# EAGLE design Board_760032 (EAGLE 9.6.2)
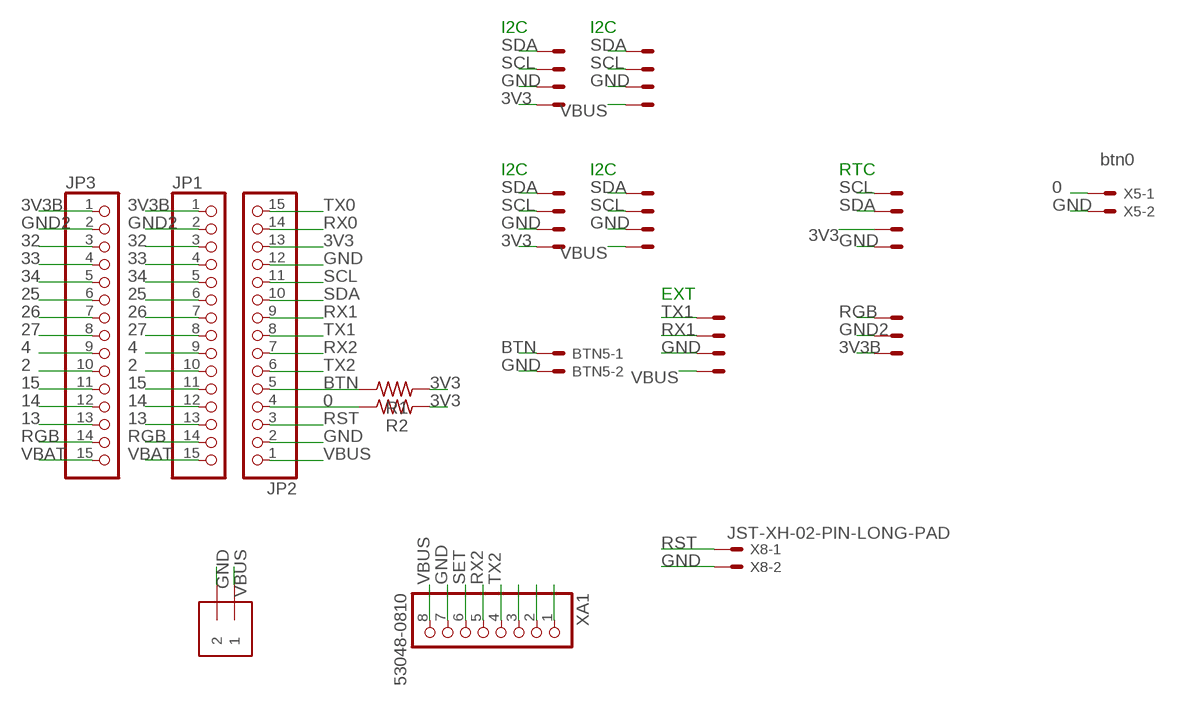
[diagram p0: schematic, sheet 1]

## Parts
BTN5  JST-XH-02-PIN-LONG-PAD  [JST-XH-02-PACKAGE-LONG-PAD]
J1  1X2-3.5MM  [1X2-3.5MM]
JP1  PINHD-1X15  [1X15]
JP2  PINHD-1X15  [1X15]
JP3  PINHD-1X15  [1X15]
R1  R-US_0207/7  [0207/7]
R2  R-US_0207/7  [0207/7]
RTC  JST-XH-04-PIN-LONG-PAD  [JST-XH-04-PACKAGE-LONG-PAD]
X1  JST-XH-04-PIN-LONG-PAD  [JST-XH-04-PACKAGE-LONG-PAD]
X2  JST-XH-04-PIN-LONG-PAD  [JST-XH-04-PACKAGE-LONG-PAD]
X3  JST-XH-04-PIN-LONG-PAD  [JST-XH-04-PACKAGE-LONG-PAD]
X4  JST-XH-03-PIN-LONG-PAD  [JST-XH-03-PACKAGE-LONG-PAD]
X5  btn0  JST-XH-02-PIN-LONG-PAD  [JST-XH-02-PACKAGE-LONG-PAD]
X6  JST-XH-04-PIN-LONG-PAD  [JST-XH-04-PACKAGE-LONG-PAD]
X8  JST-XH-02-PIN-LONG-PAD  [JST-XH-02-PACKAGE-LONG-PAD]
X9  JST-XH-04-PIN-LONG-PAD  [JST-XH-04-PACKAGE-LONG-PAD]
XA1  53048-0810  [MOLEX_53048-0810]

## Nets
0: JP2.4 R2.1 X5.1
2: JP1.10 JP3.10
3V3: JP2.13 R1.2 R2.2 RTC.3 X1.4 X3.4
3V3B: JP1.1 JP3.1 X4.3
4: JP1.9 JP3.9
13: JP1.13 JP3.13
14: JP1.12 JP3.12
15: JP1.11 JP3.11
25: JP1.6 JP3.6
26: JP1.7 JP3.7
27: JP1.8 JP3.8
32: JP1.3 JP3.3
33: JP1.4 JP3.4
34: JP1.5 JP3.5
BTN: BTN5.1 JP2.5 R1.1
GND: BTN5.2 J1.2 JP2.2 JP2.12 RTC.4 X1.3 X2.3 X3.3 X5.2 X6.3 X8.2 X9.3 XA1.7
GND2: JP1.2 JP3.2 X4.2
N$6: XA1.3
N$7: XA1.2
N$8: XA1.1
RGB: JP1.14 JP3.14 X4.1
RST: JP2.3 X8.1
RX0: JP2.14
RX1: JP2.9 X6.2
RX2: JP2.7 XA1.5
SCL: JP2.11 RTC.1 X1.2 X2.2 X3.2 X9.2
SDA: JP2.10 RTC.2 X1.1 X2.1 X3.1 X9.1
SET: XA1.6
TX0: JP2.15
TX1: JP2.8 X6.1
TX2: JP2.6 XA1.4
VBAT: JP1.15 JP3.15
VBUS: J1.1 JP2.1 X2.4 X6.4 X9.4 XA1.8

## Notes on the sheet
- I2C | I2C
- I2C | I2C | RTC
- EXT

## Library data of the parts
BTN5 X5 X8 = Rembrandt Electronics - JST XH Connectors v1-0:JST-XH-02-PIN: JST XH Connector 2 Pin Wire to board connector. Pitch: 2,54 mm, (0.100") Number of pins: 2 Created by Rembrandt Electronics www.rembrandtelectronics.com
J1 = adafruit:1X2: 3.5mm Terminal block http://www.ladyada.net/library/pcb/eaglelibrary.html
JP1-JP3 = pinhead:PINHD-1X15: PIN HEADER
R1 R2 = rcl:R-US_: RESISTOR, American symbol; SPICEPREFIX: R
RTC X1-X3 X6 X9 = Rembrandt Electronics - JST XH Connectors v1-0:JST-XH-04-PIN: JST XH Connector 2 Pin Wire to board connector. Pitch: 2,54 mm, (0.100") Number of pins: 4 Created by Rembrandt Electronics www.rembrandtelectronics.com
X4 = Rembrandt Electronics - JST XH Connectors v1-0:JST-XH-03-PIN: JST XH Connector 2 Pin Wire to board connector. Pitch: 2,54 mm, (0.100") Number of pins: 3 Created by Rembrandt Electronics www.rembrandtelectronics.com
XA1 = ConectorPlantower:53048-0810: 1.25mm Pitch PicoBlade Header, Right Angle, 8 Circuits Check availability <https://pricing.snapeda.com/parts/53048-0810/Molex/view-part?ref=eda>; AVAILABILITY: In Stock; CHECK_PRICES: https://www.snapeda.com/parts/53048-0810/Molex/view-part/?ref=eda; DESCRIPTION: 8 way through board PCB 90deg header | Molex Incorporated 53048-0810; MF: Molex; MP: 53048-0810; PACKAGE: None; PRICE: None; PURCHASE-URL: https://www.snapeda.com/api/url_track_click_mouser/?unipart_id=53851&manufacturer=Molex&part_name=53048-0810&search_term=picoblade 1.25mm header rightangle 8way; SNAPEDA_LINK: https://www.snapeda.com/parts/53048-0810/Molex/view-part/?ref=snap

## Board
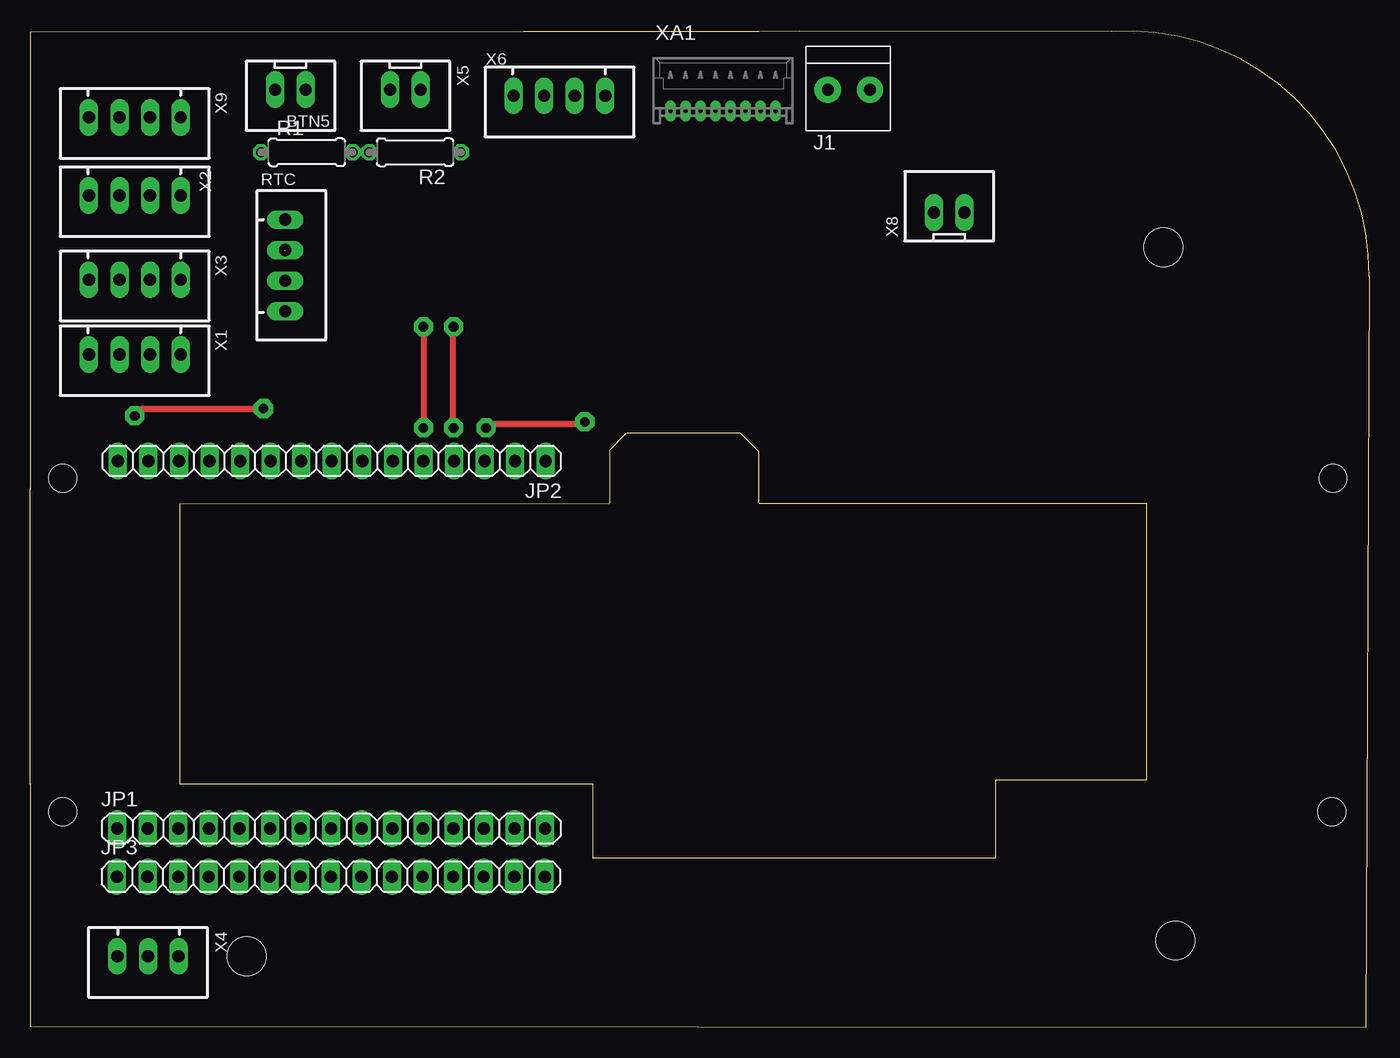
[diagram p1: board, top side]
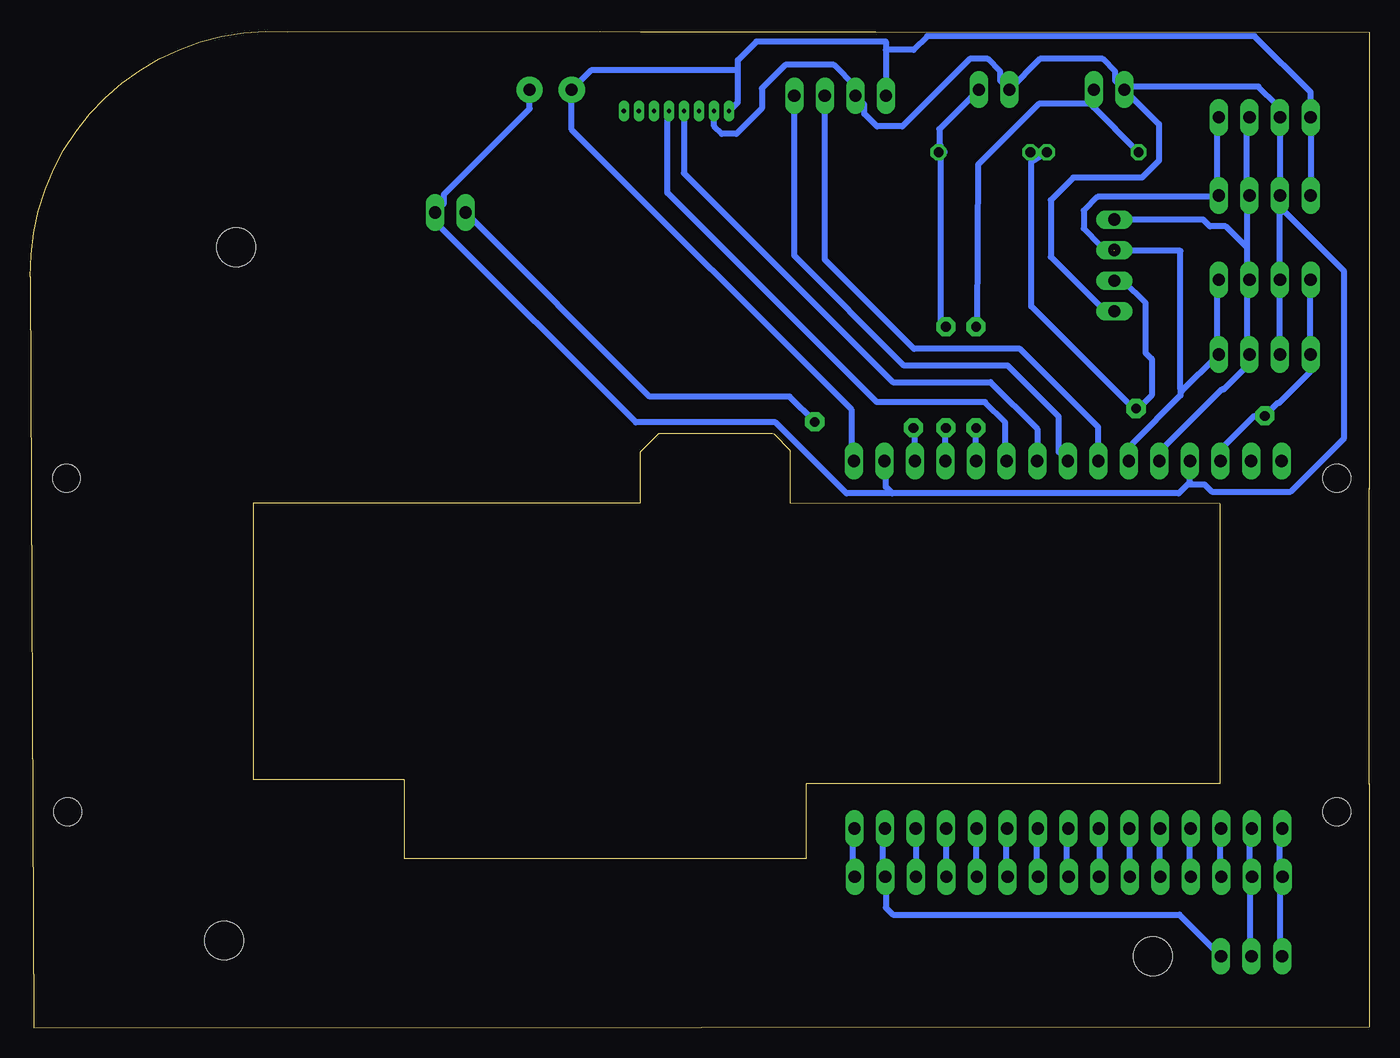
[diagram p2: board, bottom side, seen from below]

Size 111.32 x 82.81 mm. Coordinates in mm from the lower left corner, seen from the top.
Outline: 0,20.29 0,0.09 111.02,0 111.32,62.41 111.22,64.23 arc90 89.9,82.75 63.96,82.81 60.57,82.76 49.57,82.76 41,82.75 0,82.71 0,44.77
Outline: 0,20.23 0,44.82
Outline: 92.79,43.59 92.79,20.59 80.24,20.59 80.24,14.08 46.81,14.08 46.81,20.3 12.56,20.29 12.45,20.29 12.43,43.56 48.15,43.59 48.15,48 49.5,49.35 49.6,49.42 59.03,49.42 60.6,47.85 60.6,43.59 92.79,43.59
Copper layers (1*16): Top 0.035mm / dielectric 1.5mm / Bottom 0.035mm
Design rules "default *": minimum track width 0.5mm, minimum drill 0.35mm, track to track 0.78mm, track to pad 0.78mm, pad to pad 0.4mm, via to via 0.4mm, smd to smd 6mil, copper to edge 0.4mm, drill to drill 6mil, minimum pad ring 10mil, minimum via ring 8mil, stop-mask expansion 4mil, vias tented up to drill 0mil, thermal gap 10mil
Holes 2.3 mm at 2.7,45.65 108.3,45.65 108.2,17.95 2.7,17.95
Holes 3.2 mm at 94.2,64.85 95.2,7.25 18,5.95

### Footprints (pad centres in the part's own frame; a part is rotated, then mirrored left to right if it is on the bottom)
JST-XH-02-PACKAGE-LONG-PAD = drill 1.016 long: 1 -1.27,0; 2 1.27,0
1X2-3.5MM = drill 1 pad 2.184: 1 1.8,0; 2 -1.7,0
1X15 = drill 1.016 long: 1 -17.78,0; 2 -15.24,0; 3 -12.7,0; 4 -10.16,0; 5 -7.62,0; 6 -5.08,0; 7 -2.54,0; 8 0,0; 9 2.54,0; 10 5.08,0; 11 7.62,0; 12 10.16,0; 13 12.7,0; 14 15.24,0; 15 17.78,0
0207/7 = drill 0.813 octagon: 1 -3.81,0; 2 3.81,0
JST-XH-04-PACKAGE-LONG-PAD = drill 1.016 long: 1 -3.81,0; 2 -1.27,0; 3 1.27,0; 4 3.81,0
JST-XH-03-PACKAGE-LONG-PAD = drill 1.016 long: 1 -2.54,0; 2 0,0; 3 2.54,0
MOLEX_53048-0810 = drill 0.35 pad 0.597 long: 1 4.375,0.02; 2 3.125,0.02; 3 1.875,0.02; 4 0.625,0.02; 5 -0.625,0.02; 6 -1.875,0.02; 7 -3.125,0.02; 8 -4.375,0.02

### Placement (x,y rotation side)
BTN5  21.64,77.95 180 top
J1  68.1,77.95 180 top
JP1  25.02,16.56 0 top
JP2  25.08,47.1 180 top
JP3  25,12.55 0 top
R1  23,72.75 0 top
R2  32,72.75 180 top
RTC  21.2,63.35 270 top
X1  8.7,55.95 180 top
X2  8.7,69.15 180 top
X3  8.7,62.15 180 top
X4  9.8,5.95 180 top
X5  31.2,77.95 180 top
X6  44,77.45 180 top
X8  76.4,67.75 0 top
X9  8.7,75.65 180 top
XA1  57.6,76.15 0 top

### Tracks (layer width: path | path; a pad name or v marks a point on that pad's centre or on a via)
0  (via drill 0.8 pad 1.6)
  Top 0.5: v35.2,58.25 35.1,58.15 35.1,49.95 v35.2,49.85
  Bottom 0.5: 35.31,72.75 R2.1 35.76,72.7 35.76,73.39 | 35.76,73.39 35.66,73.3 35.66,58.7 v35.2,58.25 | JP2.4 35.23,49.81 v35.2,49.85 | X5.1 35.76,74.67 35.76,73.39
2
  Bottom 0.5: JP3.10 30.2,12.55 30.2,16.55 JP1.10
3V3  (via drill 0.8 pad 1.6)
  Top 0.5: v8.7,50.85 9.3,51.45 v19.4,51.45
  Bottom 0.5: X1.4 4.95,56.05 4.95,62.05 5.1,62.15 X3.4 | 12.2,48.3 12.2,47.3 JP2.13 12.38,48.02 9.55,50.85 v8.7,50.85 7.63,51.92 7.5,51.92 4.72,54.7 4.72,55.78 X1.4 | 4.7,55.8 X1.4 | 18.1,55.6 18.1,55.55 | 18.1,55.55 18.1,52.55 19.2,51.45 v19.4,51.45 19.7,51.55 28.1,59.95 28.1,71.96 R1.2 R2.2 | 18.1,55.55 18.6,56.05 18.6,60.24 20.41,62.05 21.17,62.05 RTC.3
3V3B
  Bottom 0.5: 7.45,12.55 7.45,16.55 JP1.1 | 7.45,12.55 JP3.1 | 7.45,12.55 7.45,6.14 X4.3
4
  Bottom 0.5: JP3.9 27.7,12.55 27.7,16.55 JP1.9
13
  Bottom 0.5: JP3.13 37.7,16.55 JP1.13
14
  Bottom 0.5: JP3.12 35.2,12.55 35.2,16.55 JP1.12
15
  Bottom 0.5: JP3.11 32.7,12.55 32.7,16.55 JP1.11
25
  Bottom 0.5: JP3.6 19.95,12.55 JP1.6
26
  Bottom 0.5: JP3.7 22.45,16.55 JP1.7
27
  Bottom 0.5: JP3.8 25.2,12.55 25.2,16.55 JP1.8
32
  Bottom 0.5: JP3.3 12.45,12.55 12.45,16.55 JP1.3
33
  Bottom 0.5: JP3.4 14.95,12.55 14.95,16.55 JP1.4
34
  Bottom 0.5: JP3.5 17.45,12.55 17.45,16.55 JP1.5
BTN  (via drill 0.8 pad 1.6)
  Top 0.5: v32.7,58.25 v32.7,49.85
  Bottom 0.5: JP2.5 v32.7,49.84 v32.7,49.85 | BTN5.1 22.91,76.47 R1.1 23.2,76.76 27.49,76.76 32.51,71.74 32.59,58.46 v32.7,58.25
GND
  Bottom 0.5: X2.3 7.45,69.3 7.45,75.55 X9.3 7.7,75.92 7.7,76.68 9.23,78.2 20.12,78.2 BTN5.2 | 14.83,47.19 JP2.12 14.91,45.34 15.1,45.15 | 39.65,44.4 40.2,44.95 40.2,47.05 JP2.2 40.45,47.24 | 39.65,44.4 15.85,44.4 15.1,45.15 | X1.3 7.45,56.05 7.45,62.05 X3.3 7.45,62.3 7.45,67.75 | 39.65,44.4 43.45,44.4 49.35,50.3 60.98,50.3 77.67,66.99 X8.2 76.92,68.5 76.92,69.25 69.8,76.38 J1.2 | 7.45,67.75 7.45,69.05 X2.3 | XA1.7 54.65,76.34 | XA1.7 54.3,76 | 43.2,77.05 X6.3 | 7.2,69.05 X2.3 | 15.1,45.15 13.72,45.15 13.12,44.55 6.55,44.55 2.1,49 2.1,62.85 6.99,67.75 7.45,67.75 | X6.3 41.98,76.7 41.98,75.95 40.93,74.9 38.82,74.9 33.21,80.5 31.73,80.5 30.68,79.45 30.68,78.7 X5.2 27.38,80.5 22.17,80.5 21.12,79.45 21.12,78.7 BTN5.2 | X6.3 42.73,78.21 44.53,80 48.55,80 50.5,78.05 50.5,76.4 52.62,74.28 53.83,74.28 54.48,74.93 XA1.7 | RTC.4 21.97,59.55 26.48,64.06 26.48,68.78 24.61,70.65 18.9,70.65 17.5,72.05 17.5,75.08 BTN5.2
GND2
  Bottom 0.5: 9.95,12.55 9.95,16.55 JP1.2 | 9.95,12.55 JP3.2 | 9.95,12.55 9.95,6.1 X4.2
RGB
  Bottom 0.5: JP1.14 40.45,16.55 40.45,12.55 JP3.14 40.2,12.51 40.2,9.99 39.61,9.4 15.79,9.4 X4.1
RST  (via drill 0.8 pad 1.6)
  Top 0.5: v37.9,49.85 38.2,50.15 45.9,50.15 v46.1,50.35
  Bottom 0.5: X8.1 59.83,52.45 48.2,52.45 v46.1,50.35 46.2,50.75 | JP2.3 37.78,49.72 v37.9,49.85
RX1
  Bottom 0.5: X6.2 45.27,63.83 37.85,56.41 29.04,56.41 22.54,49.91 JP2.9
RX2
  Bottom 0.5: XA1.5 56.98,71.02 39.61,53.65 31.5,53.65 27.61,49.76 JP2.7
SCL
  Bottom 0.5: X1.2 10.2,56.05 10.2,62.05 X3.2 10.2,62.3 10.2,64.85 | 10.2,55.55 10.2,55.8 X1.2 | 10.2,68.55 10.2,69.05 X2.2 | X9.2 10.2,75.55 10.2,69.3 X2.2 | 10.2,64.85 10.2,68.3 X2.2 | 21.2,67.05 RTC.1 13.82,67.16 13.25,66.6 11.95,66.6 10.2,64.85 | 10.2,55.55 X1.2 | 10.2,55.55 10.2,54.96 12.11,53.05 12.27,53.05 17.03,48.28 | 17.03,48.28 17.2,48.11 | JP2.11 17.03,47.53 17.03,48.28
SDA  (1 unrouted)
  Bottom 0.5: X2.1 12.7,69.3 12.7,75.55 X9.1 | 12.7,61.3 12.7,62.05 X3.1 12.7,61.3 | 12.7,61.3 12.7,56.05 X1.1 12.7,55.8 15.57,52.92 15.7,53.05 | 21.15,64.6 RTC.2 | 12.95,69.3 X2.1 | 21.4,64.6 RTC.2 | 21.2,64.55 15.7,64.55 15.7,53.05 | 15.7,53.05 15.7,52.55 19.7,48.55 19.7,47.4 JP2.10 | RTC.2 21.63,65.05 22.39,65.05 23.75,66.42 23.75,67.9 22.61,69.05 12.61,69.05 X2.1
TX1
  Bottom 0.5: 25.2,47.3 JP2.8 25.82,47.85 25.82,50.78 30.07,55.03 38.68,55.03 47.8,64.15 X6.1
TX2
  Bottom 0.5: JP2.6 30.27,47.22 30.27,50.31 31.94,51.98 40.95,51.98 58.35,69.38 58.35,76.04 XA1.4
VBAT
  Bottom 0.5: JP3.15 42.95,12.55 42.95,16.55 JP1.15
VBUS
  Bottom 0.5: 4.95,75.8 X9.4 | 52.5,79.55 52.5,76.89 XA1.8 | 52.5,79.55 52.5,80.4 50.95,81.95 40.2,81.95 40.2,81.25 | 5.1,75.65 X9.4 | 40.2,81.25 37.9,81.25 36.75,82.4 9.55,82.4 4.89,77.74 X9.4 | 42.95,47.2 JP2.1 | 40.2,81.25 40.2,77.55 X6.4 40.2,77.05 40.2,76.55 | 42.7,47.55 JP2.1 | 52.5,79.55 64.7,79.55 J1.1 66.3,74.64 43.05,51.39 43.05,47.3 JP2.1 | X9.4 X2.4